# EAGLE design furnace_monitor (EAGLE 5.10)
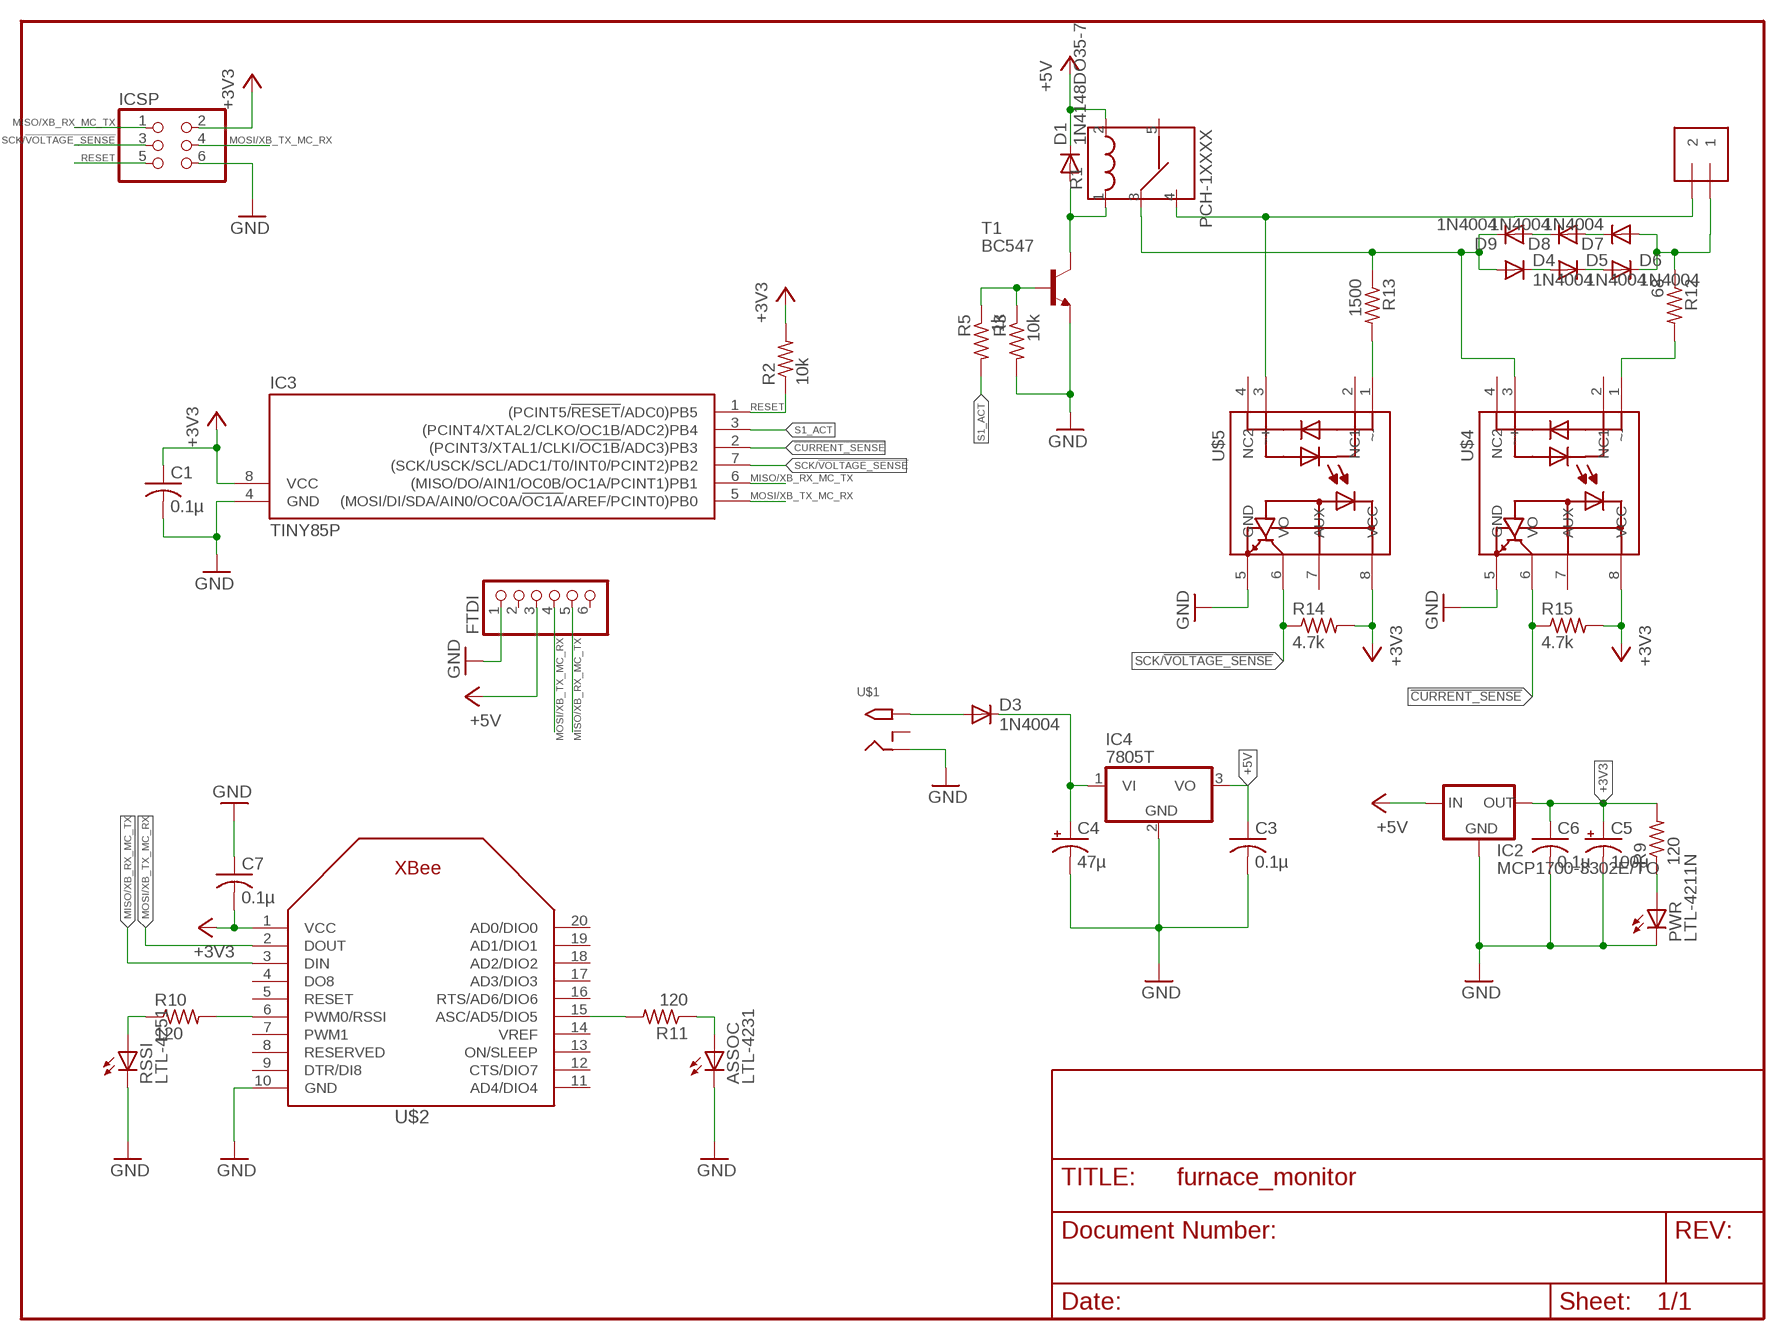
[diagram p0: schematic, sheet 1]

## Parts
ASSOC  LTL-4231  LED3MM  [LED3MM]
C1  0.1µ  C-US025-025X050  [C025-025X050]
C3  0.1µ  C-US025-025X050  [C025-025X050]
C4  47µ  CPOL-USE2-5  [E2-5]
C5  100µ  CPOL-USE2-5  [E2-5]
C6  0.1µ  C-US025-025X050  [C025-025X050]
C7  0.1µ  C-US025-025X050  [C025-025X050]
D1  1N4148DO35-7  [DO35-7]
D3  1N4004  [DO41-10]
D4  1N4004  [DO41-10]
D5  1N4004  [DO41-10]
D6  1N4004  [DO41-10]
D7  1N4004  [DO41-10]
D8  1N4004  [DO41-10]
D9  1N4004  [DO41-10]
FTDI  PINHD-1X6/90  [1X06/90]
FURNACE  1X2-3.5MM  [1X2-3.5MM]
IC2  MCP1700-3302E/TO  ULINK_MC1700  [ULINK_TO92]
IC3  TINY85P  [DIL08]
IC4  7805T  [TO220H]
ICSP  PINHD-2X3  [2X03]
PWR  LTL-4211N  LED3MM  [LED3MM]
R1  PCH-1XXXX  [PCH-1XXXX]
R2  10k  R-US_0207/10  [0207/10]
R3  10k  R-US_0204/7  [0204/7]
R5  1k  R-US_0204/7  [0204/7]
R9  120  R-US_0204/7  [0204/7]
R10  120  R-US_0204/7  [0204/7]
R11  120  R-US_0204/7  [0204/7]
R12  68  R-US_0204/7  [0204/7]
R13  1500  R-US_0204/7  [0204/7]
R14  4.7k  R-US_0204/7  [0204/7]
R15  4.7k  R-US_0204/7  [0204/7]
RSSI  LTL-4251  LED3MM  [LED3MM]
T1  BC547  -NPN-TO92-CBE  [TO92-CBE]
U$1  MINIMIDI_2.1MMJACK  [MINIMIDI_PJ-102A]
U$2  ULINK_XBEE  [ULINK_XBEE]
U$4  MID400  [DIL08]
U$5  MID400  [DIL08]

## Nets
!CURRENT_SENSE!: IC3.2((PCINT3/XTAL1/CLKI/!OC1B!/ADC3)PB3) R15.1 U$4.6(VO)
+3V3: C1.1 C5.+ C6.1 C7.2 IC2.3(OUT) IC3.8(VCC) ICSP.2 R2.2 R9.2 R14.2 R15.2 U$2.1(VCC) U$4.8(VCC) U$5.8(VCC)
+5V: C3.1 D1.C FTDI.3 IC2.2(IN) IC4.3(VO) R1.2
GND: ASSOC.K(C) C1.2 C3.2 C4.- C5.- C6.2 C7.1 FTDI.1 IC2.1(GND) IC3.4(GND) IC4.2(GND) ICSP.6 PWR.K(C) R3.2 RSSI.K(C) T1.E U$1.RING U$2.10(GND) U$4.5(GND) U$5.5(GND)
MISO/XB_RX_MC_TX: FTDI.5 IC3.6((MISO/DO/AIN1/OC0B/OC1A/PCINT1)PB1) ICSP.1 U$2.3(DIN)
MOSI/XB_TX_MC_RX: FTDI.4 IC3.5((MOSI/DI/SDA/AIN0/OC0A/!OC1A!/AREF/PCINT0)PB0) ICSP.4 U$2.2(DOUT)
N$1: D1.A R1.1 T1.C
N$2: PWR.A R9.1
N$4: R3.1 R5.1 T1.B
N$5: C4.+ D3.C IC4.1(VI)
N$10: D3.A U$1.TIP
N$11: ASSOC.A R11.1
N$12: R10.2 U$2.6(PWM0/RSSI)
N$13: R10.1 RSSI.A
N$14: R11.2 U$2.15(ASC/AD5/DIO5)
N$15: FURNACE.2 R1.4 U$5.3(~+)
N$19: D8.C D9.A
N$20: D7.C D8.A
N$21: D6.C D7.A FURNACE.1 R12.1
N$22: D5.C D6.A
N$23: D4.C D5.A
N$24: R12.2 U$4.1(~-)
N$25: R13.2 U$5.1(~-)
N$26: D4.A D9.C R1.3 R13.1 U$4.3(~+)
RESET: IC3.1((PCINT5/!RESET!/ADC0)PB5) ICSP.5 R2.1
S1_ACT: IC3.3((PCINT4/XTAL2/CLKO/OC1B/ADC2)PB4) R5.2
SCK/!VOLTAGE_SENSE!: IC3.7((SCK/USCK/SCL/ADC1/T0/INT0/PCINT2)PB2) ICSP.3 R14.1 U$5.6(VO)
Unconnected: FTDI.2 FTDI.6 R1.5 U$1.RING_SW U$2.4(DO8) U$2.5(RESET) U$2.7(PWM1) U$2.8(RESERVED) U$2.9(DTR/DI8) U$2.11(AD4/DIO4) U$2.12(CTS/DIO7) U$2.13(ON/SLEEP) U$2.14(VREF) U$2.16(RTS/AD6/DIO6) U$2.17(AD3/DIO3) U$2.18(AD2/DIO2) U$2.19(AD1/DIO1) U$2.20(AD0/DIO0) U$4.2(NC1) U$4.4(NC2) U$4.7(AUX) U$5.2(NC1) U$5.4(NC2) U$5.7(AUX)

## Library data of the parts
ASSOC PWR RSSI = led:LED: LED OSRAM: - CHIPLED LG R971, LG N971, LY N971, LG Q971, LY Q971, LO R971, LY R971 LH N974, LH R974 LS Q976, LO Q976, LY Q976 LO Q996 - Hyper CHIPLED LW Q18S LB Q993, LB Q99A, LB R99A - SideLED LS A670, LO A670, LY A670, LG A670, LP A670 LB A673, LV A673, LT A673, LW A673 LH A674 LY A675 LS A676, LA A676, LO A676, LY A676, LW A676 LS A679, LY A679, LG A679 - Hyper Micro SIDELED® LS Y876, LA Y876, LO Y876, LY Y876 LT Y87S - SmartLED LW L88C, LW L88S LB L89C, LB L89S, LG L890 LS L89K, LO L89K, LY L89K LS L896, LA L896, LO L896, LY L896 - TOPLED LS T670, LO T670, LY T670, LG T670, LP T670 LSG T670, LSP T670, LSY T670, LOP T670, LYG T670 LG T671, LOG T671, LSG T671 LB T673, LV T673, LT T673, LW T673 LH T674 LS T676, LA T676, LO T676, LY T676, LB T676, LH T676, LSB T676, LW T676 LB T67C, LV T67C, LT T67C, LS T67K, LO T67K, LY T67K, LW E67C LS E67B, LA E67B, LO E67B, LY E67B, LB E67C, LV E67C, LT E67C LW T67C LS T679, LY T679, LG T679 LS T770, LO T770, LY T770, LG T770, LP T770 LB T773, LV T773, LT T773, LW T773 LH T774 LS E675, LA E675, LY E675, LS T675 LS T776, LA T776, LO T776, LY T776, LB T776 LHGB T686 LT T68C, LB T68C - Hyper Mini TOPLED® LB M676 - Mini TOPLED Santana® LG M470 LS M47K, LO M47K, LY M47K Source: http://www.osram.convergy.de LUXEON: - LUMILED® LXK2-PW12-R00, LXK2-PW12-S00, LXK2-PW14-U00, LXK2-PW14-V00 LXK2-PM12-R00, LXK2-PM12-S00, LXK2-PM14-U00 LXK2-PE12-Q00, LXK2-PE12-R00, LXK2-PE12-S00, LXK2-PE14-T00, LXK2-PE14-U00 LXK2-PB12-K00, LXK2-PB12-L00, LXK2-PB12-M00, LXK2-PB14-N00, LXK2-PB14-P00, LXK2-PB14-Q00 LXK2-PR12-L00, LXK2-PR12-M00, LXK2-PR14-Q00, LXK2-PR14-R00 LXK2-PD12-Q00, LXK2-PD12-R00, LXK2-PD12-S00 LXK2-PH12-R00, LXK2-PH12-S00 LXK2-PL12-P00, LXK2-PL12-Q00, LXK2-PL12-R00 Source: www.luxeon.com KINGBRIGHT: KA-3528ASYC Source: www.kingbright.com
C1 C3 C6 C7 = rcl:C-US: CAPACITOR, American symbol
C4 C5 = rcl:CPOL-US: POLARIZED CAPACITOR, American symbol
D1 = diode:1N4148: DIODE high speed (Philips)
D3-D9 = diode:1N4004: DIODE general purpose rectifier, 1 A
FTDI = pinhead:PINHD-1X6: PIN HEADER
FURNACE = adafruit:1X2: 3.5mm Terminal block http://www.ladyada.net/library/pcb/eaglelibrary.html
IC2 = xbee:ULINK_MC1700: VOLTAGE REGULATOR
IC3 = iswba:TINY85: MICROCONTROLLER 2.7 V 1 Kbytes FLASH 64 bytes EEPROM 4-channel 10 bit ADC
IC4 = adafruit:78*: Positive VOLTAGE REGULATOR Added bigger pads to the TO-92 package
ICSP = pinhead:PINHD-2X3: PIN HEADER
R1 = iswba:PCH-1XXXX: Tyco PCH-105D2H,001
R2 R3 R5 R9-R15 = rcl:R-US_: RESISTOR, American symbol
T1 = transistor-neu-to92:*-NPN-: NPN Transistror
U$1 = boarduino:MINIMIDI_2.1MMJACK
U$2 = xbee:ULINK_XBEE
U$4 U$5 = sprinkler_timer:MID400

## Board
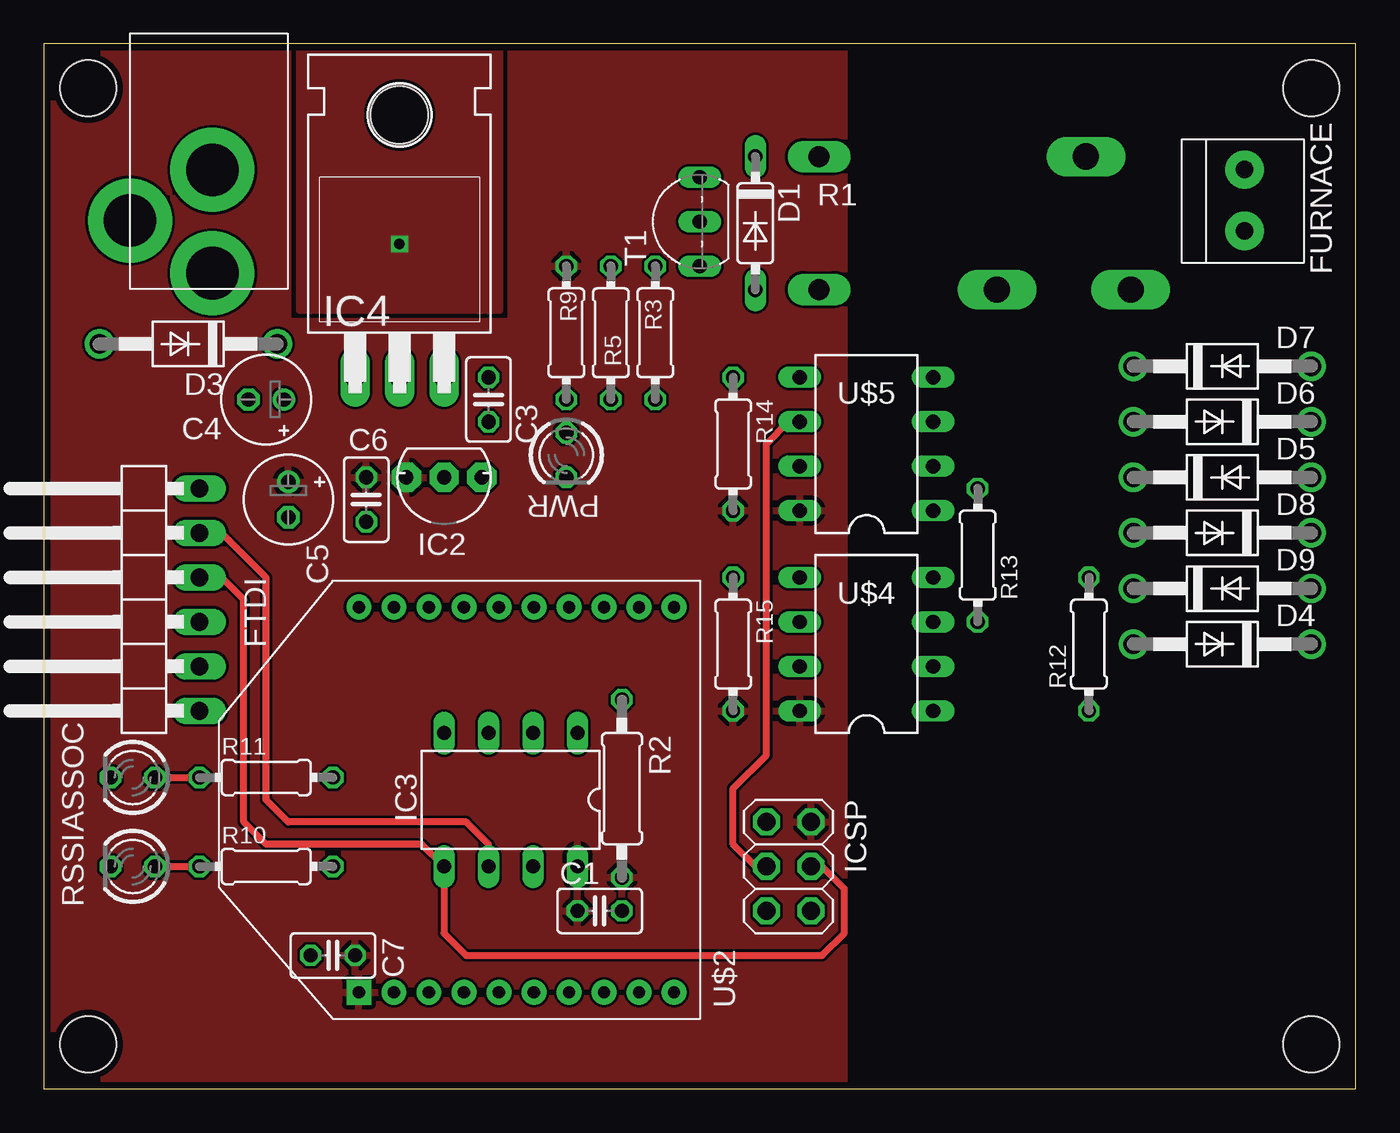
[diagram p1: board, top side]
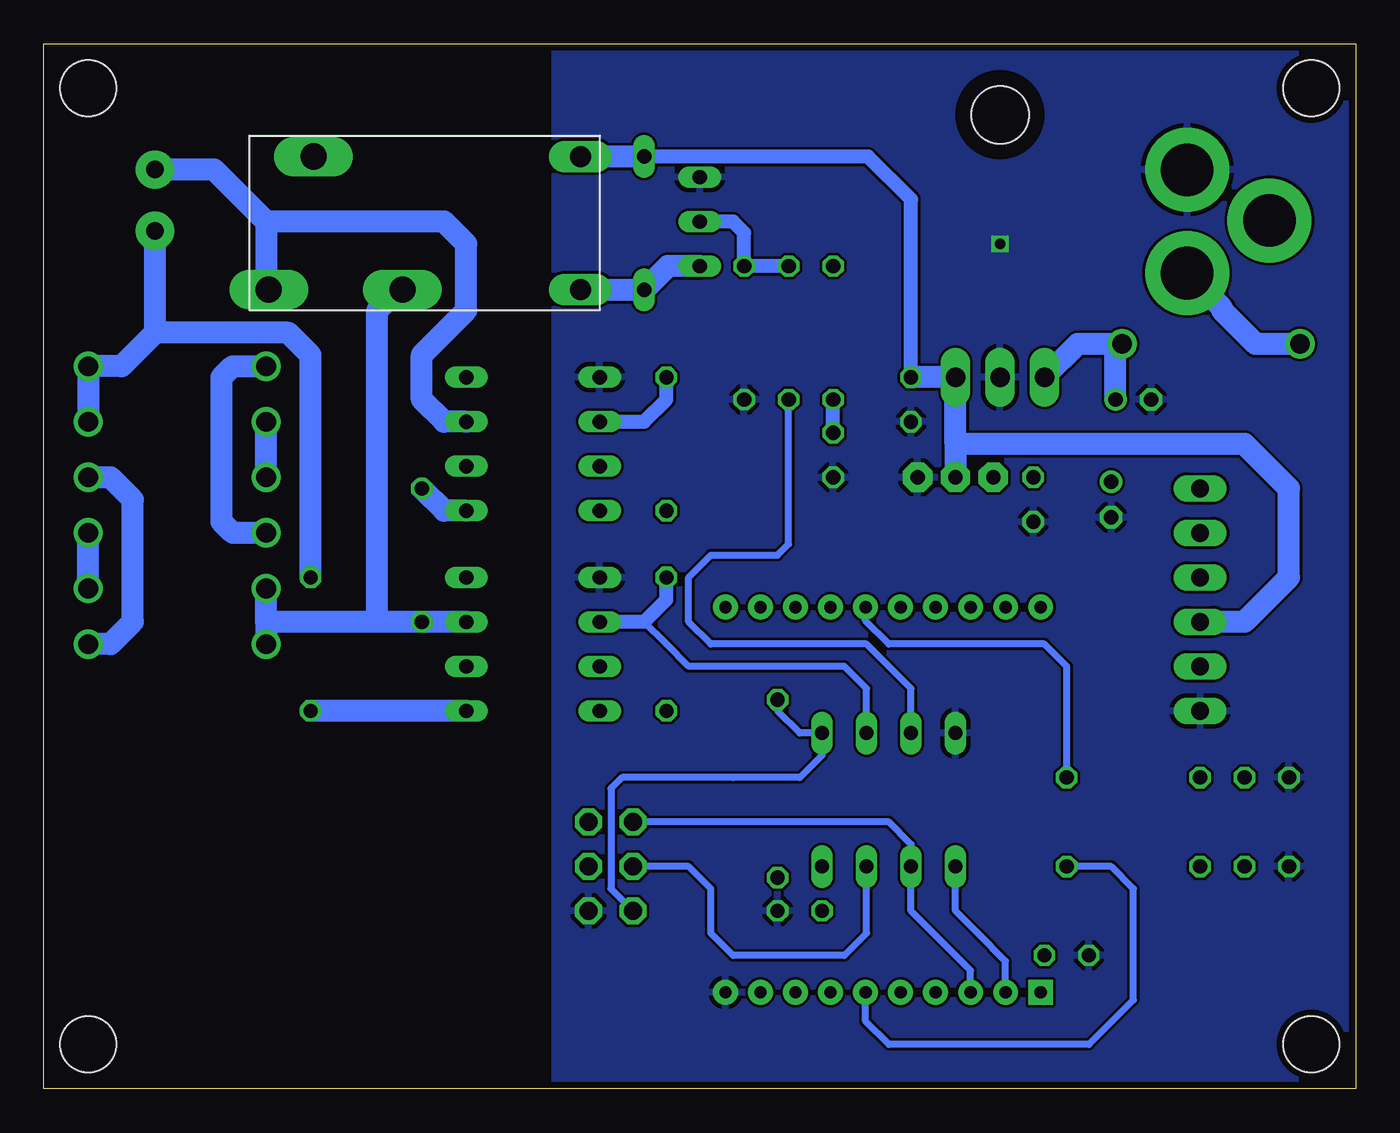
[diagram p2: board, bottom side, seen from below]

Size 74.93 x 59.69 mm. Coordinates in mm from the lower left corner, seen from the top.
Outline: 0,0 74.93,0 74.93,59.69 0,59.69 0,0
Copper layers (1*16): Top 0.0356mm / dielectric 1.5011mm / Bottom 0.0356mm
Design rules "LaenPCBOrder": minimum track width 6mil, minimum drill 13mil, track to track 6mil, track to pad 6mil, pad to pad 6mil, via to via 6mil, smd to smd 6mil, copper to edge 15mil, drill to drill 6mil, minimum pad ring 7mil, minimum via ring 7mil, stop-mask expansion 4mil, vias tented up to drill 0mil, thermal gap 10mil
Holes 3.2 mm at 72.39,2.54 2.54,2.54 72.39,57.15 2.54,57.15

### Footprints (pad centres in the part's own frame; a part is rotated, then mirrored left to right if it is on the bottom)
LED3MM = drill 0.813 octagon: A -1.27,0; K 1.27,0
C025-025X050 = drill 0.813 octagon: 1 -1.27,0; 2 1.27,0
E2-5 = drill 0.813 pad 1.27 round: + -1.016,0 | drill 0.813 pad 1.27 octagon: - 1.016,0
DO35-7 = drill 0.813 long: A 3.81,0; C -3.81,0
DO41-10 = drill 1.118 round: A 5.08,0; C -5.08,0
1X06/90 = drill 1.016 long: 1 -6.35,-3.81; 2 -3.81,-3.81; 3 -1.27,-3.81; 4 1.27,-3.81; 5 3.81,-3.81; 6 6.35,-3.81
1X2-3.5MM = drill 1 pad 2.184 round: 1 1.8,0; 2 -1.7,0
ULINK_TO92 = drill 0.813 pad 1.676 octagon: 1 -2.159,0; 2 0,0; 3 2.159,0
DIL08 = drill 0.813 long: 1 -3.81,-3.81; 2 -1.27,-3.81; 3 1.27,-3.81; 4 3.81,-3.81; 5 3.81,3.81; 6 1.27,3.81; 7 -1.27,3.81; 8 -3.81,3.81
TO220H = drill 1.118 long: 1 -2.54,-10.16; 2 0,-10.16; 3 2.54,-10.16 | hole 3.302: 0,4.826
2X03 = drill 1.016 octagon: 1 -2.54,-1.27; 2 -2.54,1.27; 3 0,-1.27; 4 0,1.27; 5 2.54,-1.27; 6 2.54,1.27
PCH-1XXXX = drill 1.2 long: 1 1.1,1.2; 2 1.1,8.8 | drill 1.5 long: 3 11.26,1.2; 4 18.9,1.2; 5 16.34,8.8
0207/10 = drill 0.813 octagon: 1 -5.08,0; 2 5.08,0
0204/7 = drill 0.813 octagon: 1 -3.81,0; 2 3.81,0
TO92-CBE = drill 0.813 long: B 0,0; C -2.54,0; E 2.54,0
MINIMIDI_PJ-102A = drill 3 pad 4.8 round: RING 0.1,-3.39; RING_SW -4.6,-6.29; TIP 0.1,-9.29
ULINK_XBEE = drill 0.7 pad 1.422 square: 1 -11,5.5 | drill 0.7 pad 1.422 round: 2 -11,3.5; 3 -11,1.5; 4 -11,-0.5; 5 -11,-2.5; 6 -11,-4.5; 7 -11,-6.5; 8 -11,-8.5; 9 -11,-10.5; 10 -11,-12.5; 11 11,-12.5; 12 11,-10.5; 13 11,-8.5; 14 11,-6.5; 15 11,-4.5; 16 11,-2.5; 17 11,-0.5; 18 11,1.5; 19 11,3.5; 20 11,5.5

### Placement (x,y rotation side)
ASSOC  5.08,17.78 180 top
C1  31.75,10.16 0 top
C3  25.4,39.37 270 top
C4  12.7,39.37 180 top
C5  13.97,33.66 270 top
C6  18.41,33.66 270 top
C7  16.51,7.62 0 top
D1  40.64,49.44 270 top
D3  8.26,42.55 180 top
D4  67.31,25.4 180 top
D5  67.31,34.92 0 top
D6  67.31,38.1 180 top
D7  67.31,41.27 0 top
D8  67.31,31.75 180 top
D9  67.31,28.57 0 top
FTDI  5.08,27.94 90 top
FURNACE  68.58,50.8 270 top
IC2  22.86,34.92 180 top
IC3  26.67,16.51 180 top
IC4  20.32,50.8 0 top
ICSP  42.55,12.7 270 top
PWR  29.84,36.2 270 top
R1  43.18,44.45 0 top
R2  33.02,17.14 270 top
R3  34.93,43.18 270 top
R5  32.38,43.18 270 top
R9  29.84,43.18 90 top
R10  12.7,12.7 0 top
R11  12.7,17.78 0 top
R12  59.69,25.4 270 top
R13  53.34,30.48 90 top
R14  39.37,36.83 270 top
R15  39.37,25.4 270 top
RSSI  5.08,12.7 180 top
T1  37.47,49.53 90 top
U$1  9.53,55.88 0 top
U$2  23.5,16.51 90 top
U$4  46.99,25.4 90 top
U$5  46.99,36.83 90 top

### Tracks (layer width: path | path; a pad name or v marks a point on that pad's centre or on a via)
!CURRENT_SENSE!
  Bottom 0.406: IC3.2 27.94,22.86 29.21,24.13 38.1,24.13 39.37,25.4 40.64,26.67
  Bottom 0.813: U$4.6 40.64,26.67 39.37,27.94 R15.1
+3V3
  pour Top: 0,0 45.72,0 45.72,59.69 26.67,59.69 26.67,43.81 13.97,43.81 13.97,59.69 0,59.69
+5V
  Bottom 0.813: D1.C 33.02,53.25 31.66,53.25 27.85,53.25 25.4,50.8 C3.1
  Bottom 1.27: 22.86,36.83 IC2.2 | 22.86,36.83 IC4.3 C3.1 | R1.2 D1.C | FTDI.3 6.35,26.67 3.81,29.21 3.81,34.29 6.35,36.83 22.86,36.83
GND  (via drill 0.6)
  other vias: 20.32,48.26
  pour Bottom: 0,0 45.72,0 45.72,59.69 0,59.69
  pour Top: 14.61,59.69 26.04,59.69 26.04,44.45 14.61,44.45
MISO/XB_RX_MC_TX
  Top 0.406: IC3.6 25.4,13.97 24.13,15.24 13.97,15.24 12.7,16.51 12.7,29.21 10.16,31.75 FTDI.5
  Bottom 0.406: U$2.3 22,6.75 22.86,7.62 25.4,10.16 IC3.6 25.4,13.97 26.67,15.24 ICSP.1
MOSI/XB_TX_MC_RX
  Top 0.406: FTDI.4 10.16,29.21 11.43,27.94 11.43,15.24 12.7,13.97 21.59,13.97 IC3.5 22.86,8.89 24.13,7.62 44.45,7.62 45.72,8.89 45.72,11.43 44.45,12.7 ICSP.4
  Bottom 0.406: IC3.5 22.86,10.16 21.59,8.89 20,7.29 U$2.2
N$1
  Bottom 1.27: R1.1 44.26,45.63 D1.A 39.28,46.99 T1.C
N$2
  Bottom 0.813: PWR.A R9.1
N$4
  Bottom 0.813: R5.1 R3.1 34.93,48.9 35.56,49.53 T1.B
N$5
  Bottom 1.27: C4.+ 13.72,42.16 D3.C 15.88,42.55 IC4.1
N$10
  Bottom 1.27: D3.A 5.71,42.55 7.62,44.45 7.62,44.59 U$1.TIP
N$11
  Top 0.406: ASSOC.A R11.1
N$12
  Bottom 0.406: U$2.6 28,3.87 26.67,2.54 15.24,2.54 12.7,5.08 12.7,11.43 13.97,12.7 R10.2
N$13
  Top 0.406: RSSI.A R10.1
N$14
  Bottom 0.406: U$2.15 28,26.73 26.67,25.4 17.78,25.4 16.51,24.13 R11.2
N$15
  Bottom 1.27: FURNACE.2 65.2,52.5 62.23,49.53 | 62.23,49.53 62.23,45.8 R1.4 | U$5.3 52.07,38.1 53.34,39.37 53.34,41.91 52.07,43.18 50.8,44.45 50.8,48.26 52.07,49.53 62.23,49.53
N$19
  Bottom 1.27: D9.A D8.C
N$20
  Bottom 1.27: D7.C 64.14,41.27 64.77,40.64 64.77,32.38 64.14,31.75 D8.A
N$21
  Bottom 1.27: 68.58,43.18 FURNACE.1 | 68.58,43.18 70.48,41.27 D7.A D6.C | R12.1 59.69,41.91 60.96,43.18 68.58,43.18
N$22
  Bottom 1.27: D5.C D6.A
N$23
  Bottom 1.27: D5.A 71.12,34.92 69.85,33.66 69.85,26.67 71.12,25.4 D4.C
N$24
  Bottom 1.27: U$4.1 R12.2
N$25
  Bottom 1.27: U$5.1 52.07,33.02 R13.2
N$26
  Bottom 1.27: U$4.3 R13.1 55.88,26.67 | R1.3 54.68,45.65 55.88,44.45 55.88,26.67 | 62.23,26.67 D4.A | 62.23,26.67 D9.C | 55.88,26.67 62.23,26.67
RESET
  Bottom 0.406: R2.1 33.02,21.59 31.75,20.32 IC3.1 30.48,19.05 31.75,17.78 35.56,17.78 41.91,17.78 42.55,17.14 42.55,11.43 ICSP.5
S1_ACT
  Bottom 0.406: IC3.3 25.4,22.86 26.67,24.13 27.94,25.4 36.83,25.4 38.1,26.67 38.1,29.21 36.83,30.48 33.02,30.48 32.38,31.11 R5.2
SCK/!VOLTAGE_SENSE!
  Top 0.406: ICSP.3 40.64,12.7 39.37,13.97 39.37,17.14 41.28,19.05 41.28,36.83 42.55,38.1 U$5.6
  Bottom 0.406: IC3.7 27.94,8.89 29.21,7.62 35.56,7.62 36.83,8.89 36.83,11.43 38.1,12.7 ICSP.3
  Bottom 0.813: U$5.6 40.64,38.1 39.37,39.37 R14.1

### Text on the board
tDocu: blk | date: